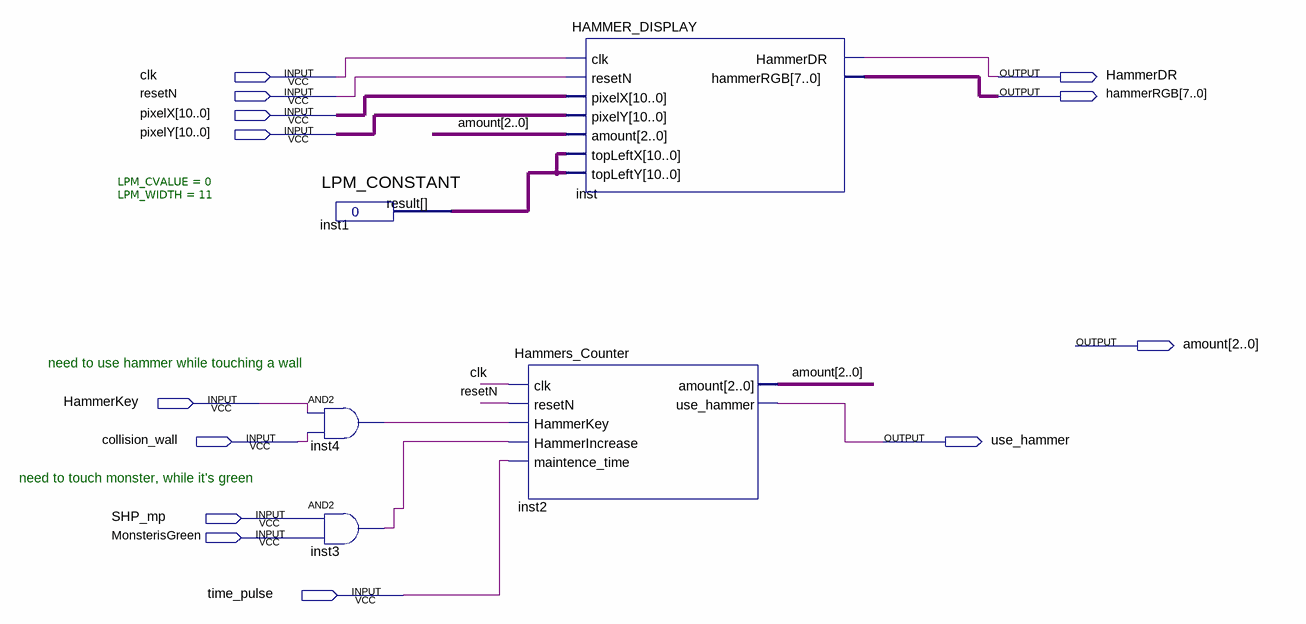
[diagram p0: schematic sheet]
// Quartus schematic HAMMER_TOP.bdf as structural Verilog: 5 symbols, 13 pins
module HAMMER_TOP (
  input  clk,
  input  resetN,
  input  [10:0] pixelX,
  input  [10:0] pixelY,
  input  HammerKey,
  input  collision_wall,
  input  SHP_mp,
  input  MonsterisGreen,
  input  time_pulse,
  output HammerDR,
  output [7:0] hammerRGB,
  output [2:0] amount,
  output use_hammer
);

  wire inst3_out, inst4_out;
  wire [10:0] inst1_result;

  LPM_CONSTANT #(.LPM_CVALUE(0), .LPM_WIDTH(11)) inst1 (.result(inst1_result));
  and inst4 (inst4_out, HammerKey, collision_wall);
  and inst3 (inst3_out, SHP_mp, MonsterisGreen);
  HAMMER_DISPLAY inst (
    .clk(clk), .resetN(resetN), .pixelX(pixelX), .pixelY(pixelY), .amount(amount), .topLeftX(inst1_result),
    .topLeftY(inst1_result), .HammerDR(HammerDR), .hammerRGB(hammerRGB));
  Hammers_Counter inst2 (
    .clk(clk), .resetN(resetN), .HammerKey(inst4_out), .HammerIncrease(inst3_out),
    .maintence_time(time_pulse), .amount(amount), .use_hammer(use_hammer));

  // Notes on the sheet:
  //   need to use hammer while touching a wall
  //   need to touch monster, while it's green
endmodule
